# EAGLE design JKW (EAGLE 5.10)
01: air_temp; 02: fuse_check; 03: dz_sig; 04: dcf77_sig; 05: i2c_scl; 06: disp_backlight; 07: up; 08: right; 09: left; 10: down; 2: sdl; 3: 3.3V; 4: gnd; 5: 5V; WAY2: GND; WAY3: Sig
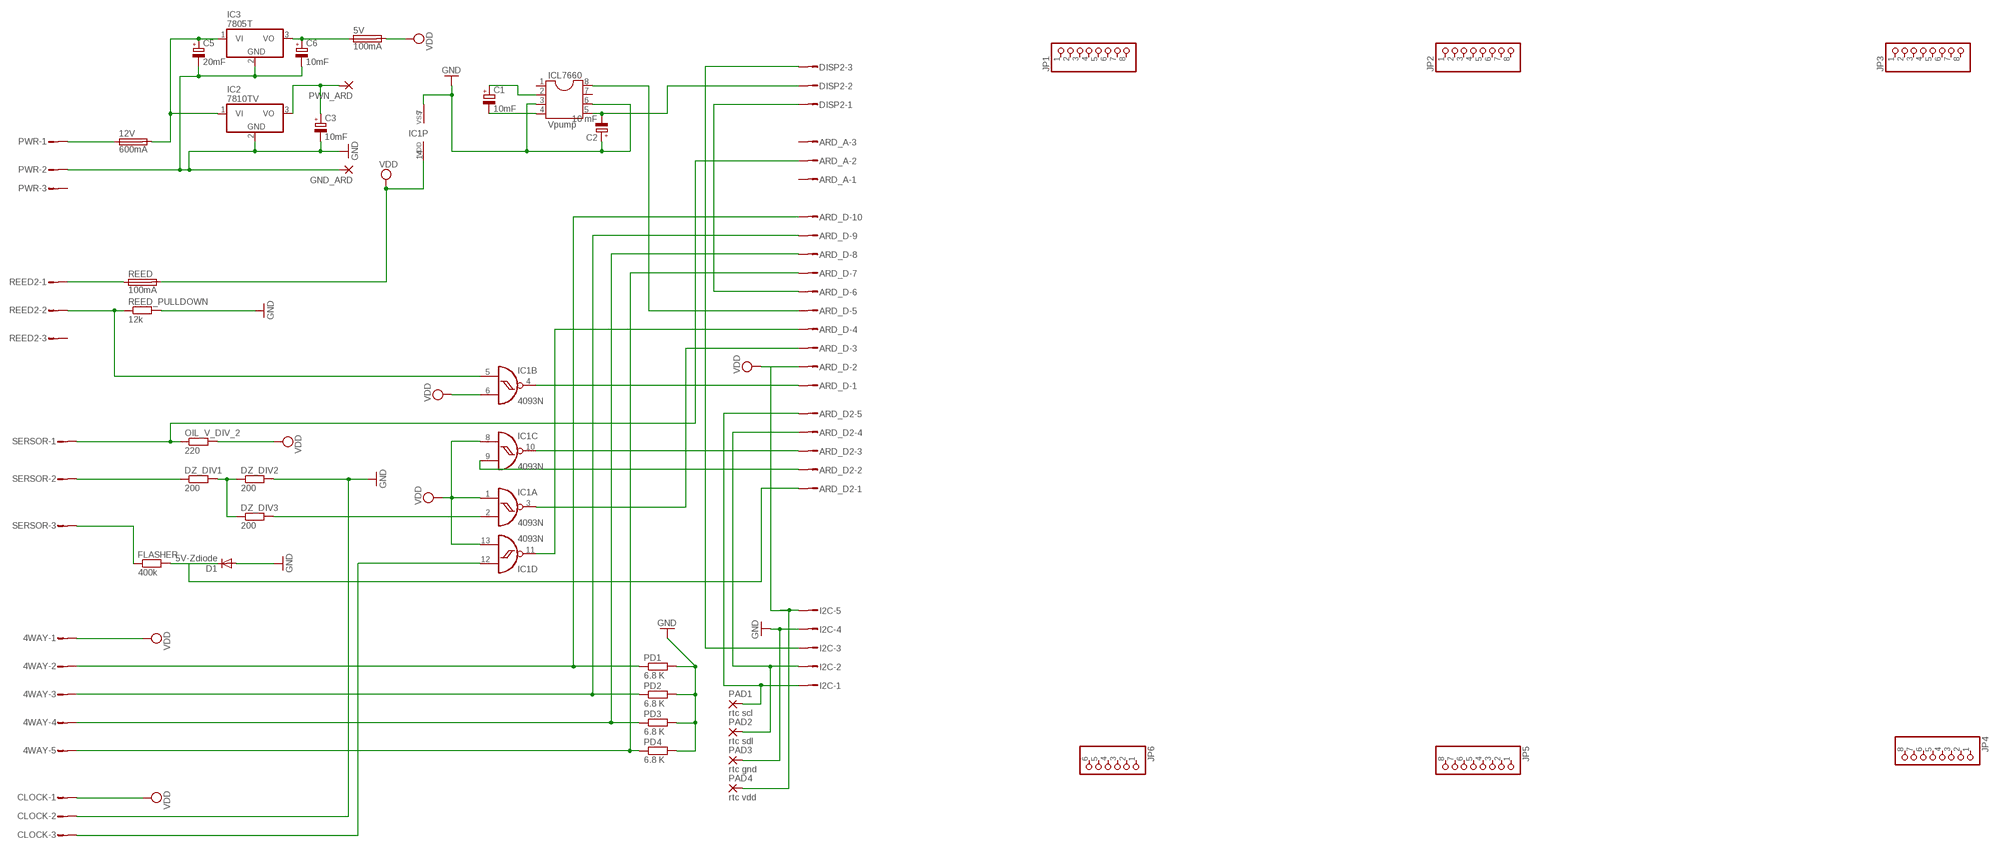
[diagram p0: schematic, sheet 1]

## Parts
4WAY  L05P  [L05P]
5V  100mA  SH22,5  [SH22,5]
12V  600mA  SH22,5  [SH22,5]
ARD_A  L03P  [L03P]
ARD_D  L10P  [L10P]
ARD_D2  L05P  [L05P]
C1  10mF  CPOL-EUE2-5  [E2-5]
C2  10 mF  CPOL-EUE2-5  [E2-5]
C3  10mF  CPOL-EUE2-5  [E2-5]
C5  20mF  CPOL-EUE2-5  [E2-5]
C6  10mF  CPOL-EUE2-5  [E2-5]
CLOCK  L03P  [L03P]
D1  5V-Zdiode  1N4004  [DO41-10]
DISP2  L03P  [L03P]
DZ_DIV1  200  R-EU_0309/12  [0309/12]
DZ_DIV2  200  R-EU_0309/12  [0309/12]
DZ_DIV3  200  R-EU_0309/12  [0309/12]
FLASHER  400k  R-EU_0309/12  [0309/12]
GND_ARD  3,81/1,1  [3,81/1,1]
I2C  L05P  [L05P]
IC1  4093N  [DIL14]
IC2  7810TV  7805T  [TO220H]
IC3  7805T  [TO220H]
ICL7660  Vpump  DIL8  [DIL08]
JP1  PINHD-1X8  [1X08]
JP2  PINHD-1X8  [1X08]
JP3  PINHD-1X8  [1X08]
JP4  PINHD-1X8  [1X08]
JP5  PINHD-1X8  [1X08]
JP6  PINHD-1X6  [1X06]
OIL_V_DIV_2  220  R-EU_0309/12  [0309/12]
PAD1  rtc scl  WIREPAD2,54/0,8  [2,54/0,8]
PAD2  rtc sdl  WIREPAD2,54/0,8  [2,54/0,8]
PAD3  rtc gnd  WIREPAD2,54/0,8  [2,54/0,8]
PAD4  rtc vdd  WIREPAD2,54/0,8  [2,54/0,8]
PD1  6.8 K  R-EU_0309/12  [0309/12]
PD2  6.8 K  R-EU_0309/12  [0309/12]
PD3  6.8 K  R-EU_0309/12  [0309/12]
PD4  6.8 K  R-EU_0309/12  [0309/12]
PWN_ARD  3,81/1,1  [3,81/1,1]
PWR  L03P  [L03P]
REED  100mA  SH22,5  [SH22,5]
REED2  L03P  [L03P]
REED_PULLDOWN  12k  R-EU_0309/12  [0309/12]
SERSOR  L03P  [L03P]

## Nets
GND: C2.+ C3.- C5.- C6.- CLOCK.2 D1.A DZ_DIV2.2 GND_ARD.1(P) I2C.4 IC1.7(P:VSS) IC2.2(GND) IC3.2(GND) ICL7660.3 ICL7660.6 PAD3.1(P) PD1.2 PD2.2 PD3.2 PD4.2 PWR.2 REED_PULLDOWN.2
N$1: 12V.1 PWR.1
N$3: REED2.1 REED.1
N$4: IC1.5(B:I0) REED2.2 REED_PULLDOWN.1
N$5: 4WAY.5 ARD_D.7 PD4.1
N$6: DISP2.3 I2C.3
N$7: ARD_D.1 IC1.4(B:O)
N$8: DZ_DIV1.1 SERSOR.2
N$9: ARD_D2.4 I2C.2 PAD2.1(P)
N$10: DZ_DIV3.2 IC1.2(A:I1)
N$11: ARD_A.2 OIL_V_DIV_2.1 SERSOR.1
N$12: ARD_D.3 IC1.3(A:O)
N$13: 4WAY.4 ARD_D.8 PD3.1
N$14: 4WAY.3 ARD_D.9 PD2.1
N$15: 4WAY.2 ARD_D.10 PD1.1
N$16: ARD_D2.5 I2C.1 PAD1.1(P)
N$18: ARD_D.4 IC1.11(D:O)
N$19: 5V.1 C6.+ IC3.3(VO)
N$20: ARD_D.6 DISP2.1
N$21: FLASHER.1 SERSOR.3
N$22: ARD_D.5 ICL7660.8
N$23: C1.- ICL7660.4
N$24: C2.- DISP2.2 ICL7660.5
N$25: C1.+ ICL7660.2
N$27: 4WAY.1 5V.2 ARD_D.2 CLOCK.1 I2C.5 IC1.1(A:I0) IC1.6(B:I1) IC1.8(C:I0) IC1.13(D:I1) IC1.14(P:VDD) OIL_V_DIV_2.2 PAD4.1(P) REED.2 ; supply symbol labelled VDD
N$28: ARD_D2.3 IC1.10(C:O)
N$29: DZ_DIV1.2 DZ_DIV2.1 DZ_DIV3.1
N$30: ARD_D2.1 D1.C FLASHER.2
N$32: C3.+ IC2.3(VO) PWN_ARD.1(P)
N$33: CLOCK.3 IC1.12(D:I0)
N$34: ARD_D2.2 IC1.9(C:I1)
N$40: 12V.2 C5.+ IC2.1(VI) IC3.1(VI)
Unconnected: ARD_A.1 ARD_A.3 ICL7660.1 ICL7660.7 JP1.1 JP1.2 JP1.3 JP1.4 JP1.5 JP1.6 JP1.7 JP1.8 JP2.1 JP2.2 JP2.3 JP2.4 JP2.5 JP2.6 JP2.7 JP2.8 JP3.1 JP3.2 JP3.3 JP3.4 JP3.5 JP3.6 JP3.7 JP3.8 JP4.1 JP4.2 JP4.3 JP4.4 JP4.5 JP4.6 JP4.7 JP4.8 JP5.1 JP5.2 JP5.3 JP5.4 JP5.5 JP5.6 JP5.7 JP5.8 JP6.1 JP6.2 JP6.3 JP6.4 JP6.5 JP6.6 PWR.3 REED2.3

## Library data of the parts
4WAY ARD_D2 I2C = con-amp-mt:L05P: AMP MT CONNECTOR
5V 12V REED = fuse:SH22,5: FUSE HOLDER grid 22,5 mm, OGN0031 8201, Schurter (Buerklin)
ARD_A CLOCK DISP2 PWR REED2 SERSOR = con-amp-mt:L03P: AMP MT CONNECTOR
ARD_D = con-amp-mt:L10P: AMP MT CONNECTOR
C1-C3 C5 C6 = resistor:CPOL-EU: POLARIZED CAPACITOR, European symbol
D1 = diode:1N4004: DIODE general purpose rectifier, 1 A
DZ_DIV1-DZ_DIV3 FLASHER OIL_V_DIV_2 PD1-PD4 REED_PULLDOWN = resistor:R-EU_: RESISTOR, European symbol
GND_ARD PWN_ARD = wirepad:3,81/1,1: THROUGH-HOLE PAD
IC1 = 40xx:4093: Quad 2-input NAND schmitt trigger
IC2 IC3 = linear:78*: Positive VOLTAGE REGULATOR Source: http://cache.national.com/ds/LM/LM78L05.pdf http://www.fairchildsemi.com/ds/LM/LM7805.pdf
ICL7660 = ic-package:DIL8: Dual In Line / Socket
JP1-JP5 = pinhead:PINHD-1X8: PIN HEADER
JP6 = pinhead:PINHD-1X6: PIN HEADER
PAD1-PAD4 = wirepad:WIREPAD: Wire PAD connect wire on PCB

## Board
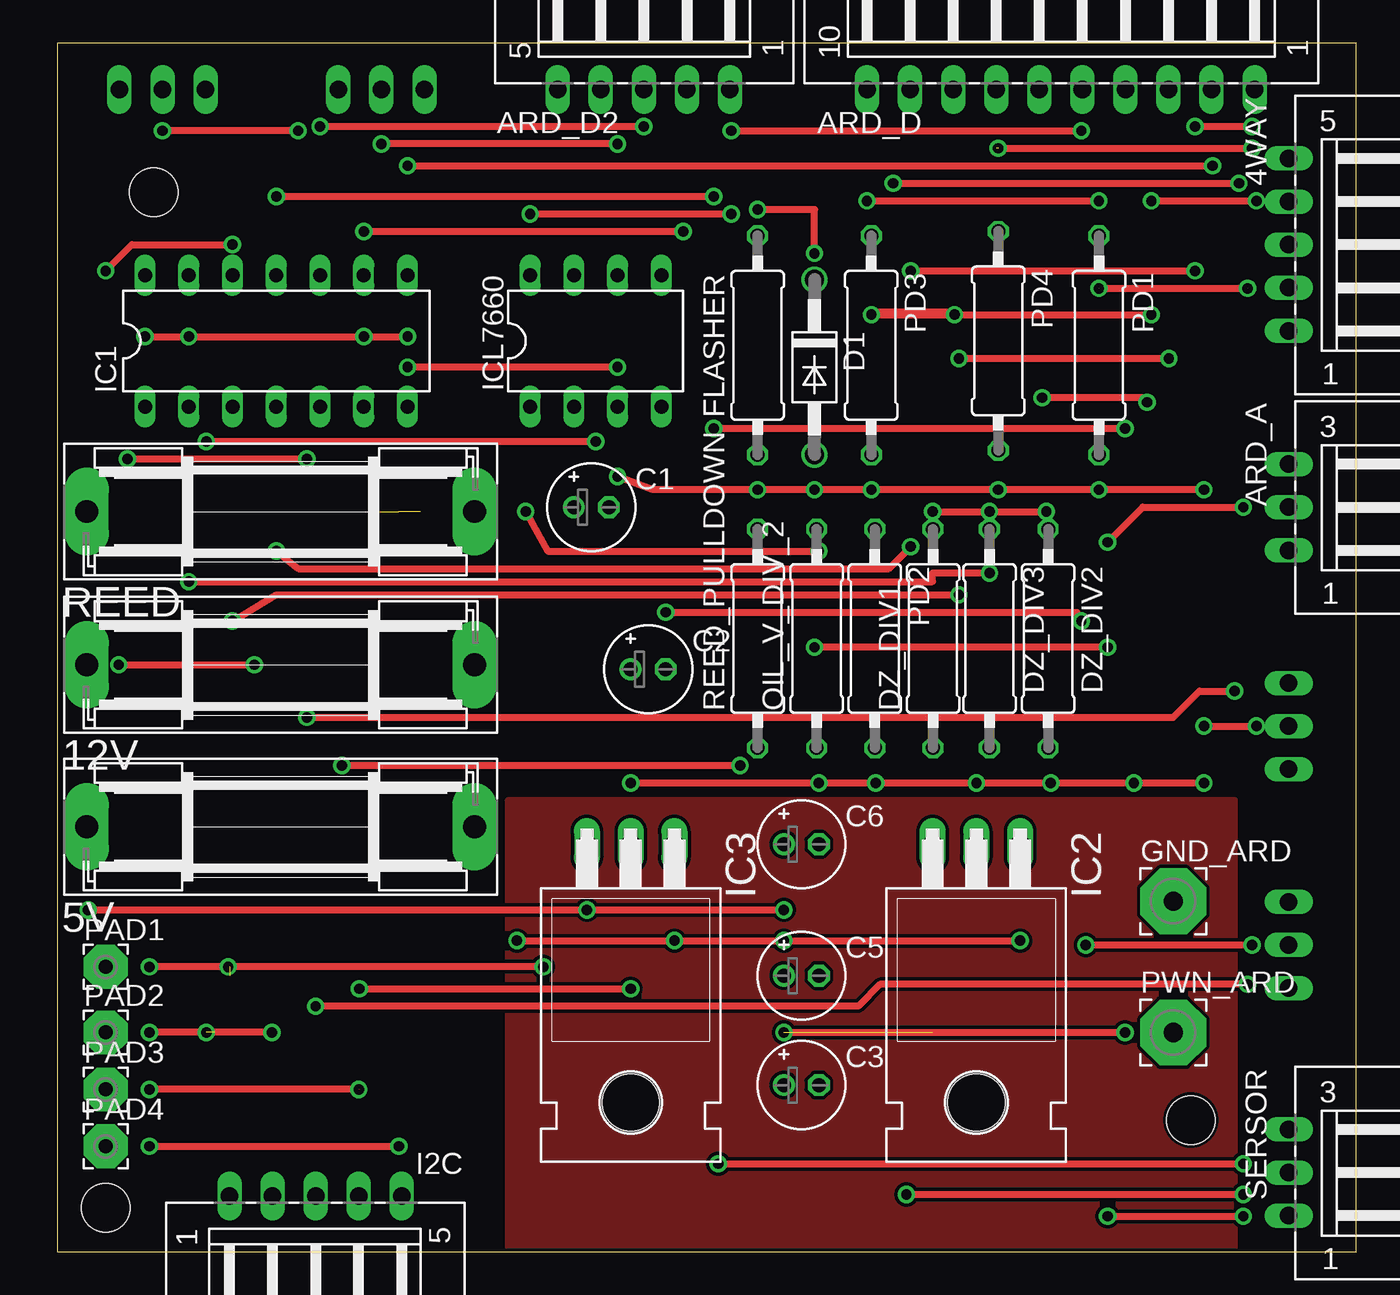
[diagram p1: board, top side]
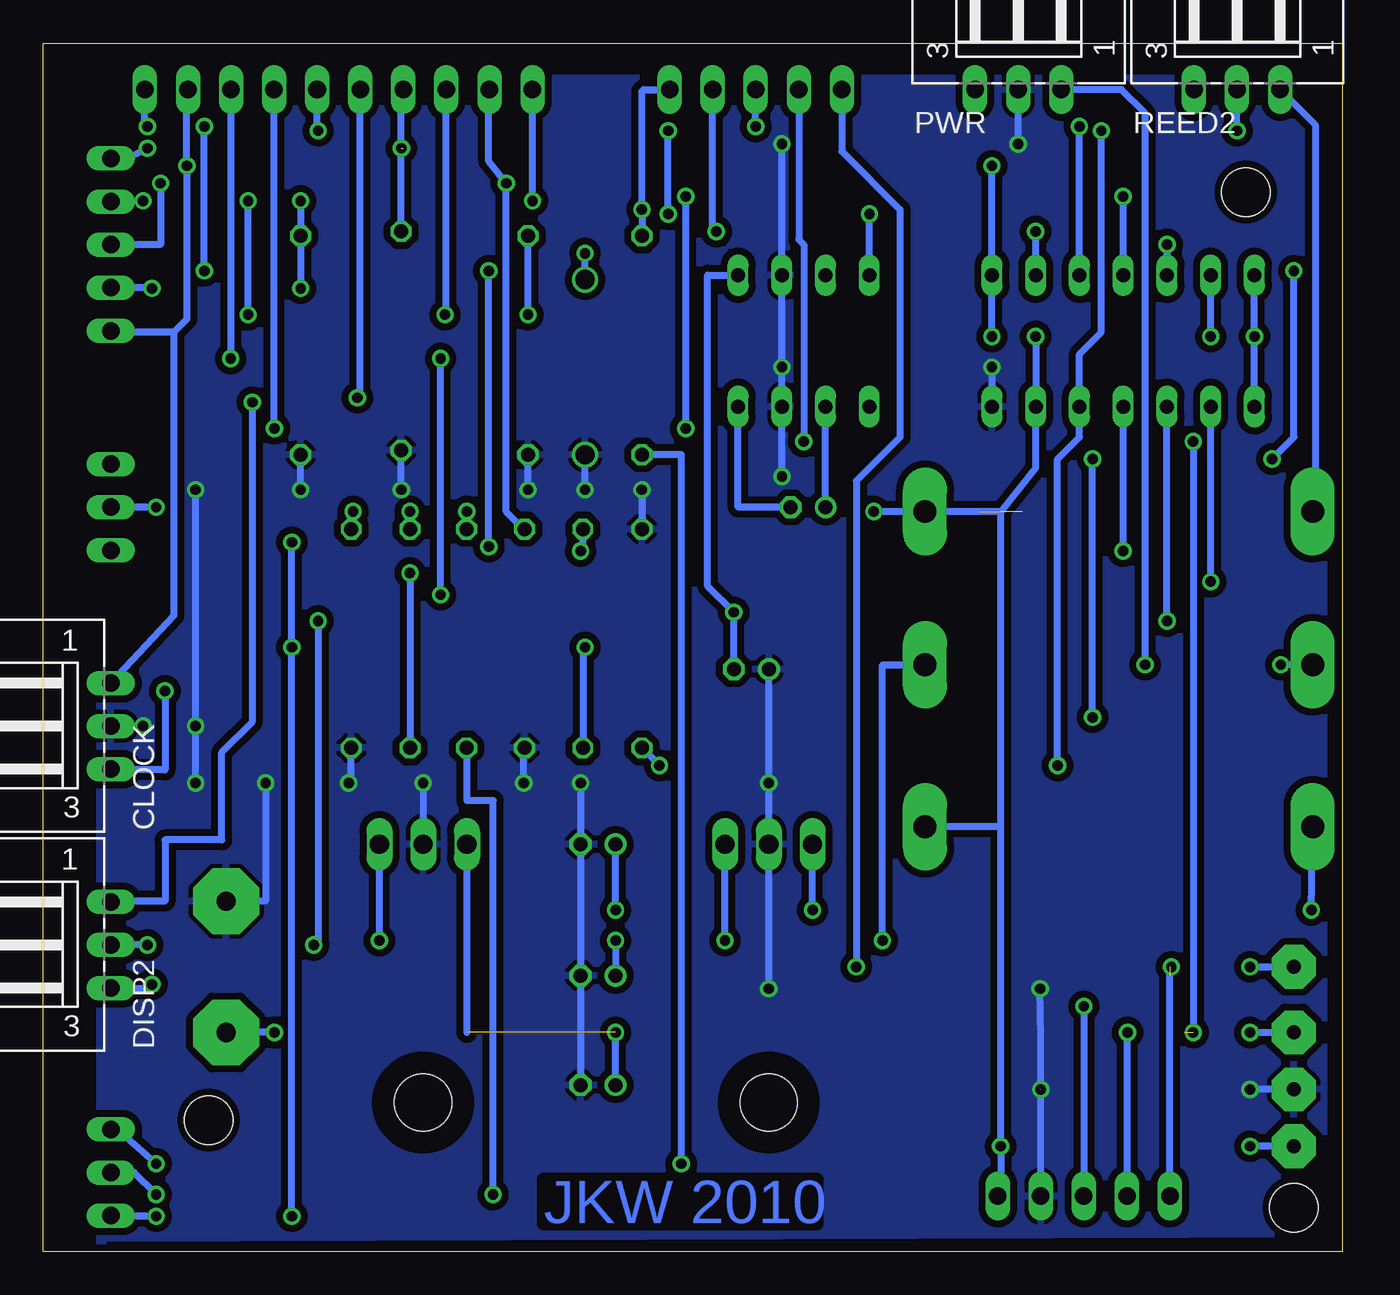
[diagram p2: board, bottom side, seen from below]

Size 75.42 x 70.13 mm. Coordinates in mm from the lower left corner, seen from the top.
Outline: 0,0 75.42,0 75.42,70.13 0,70.13 0,0
Copper layers (1*16): Top 0.035mm / dielectric 1.5mm / Bottom 0.035mm
Design rules "ZWILLING": minimum track width 0.2mm, minimum drill 0.5mm, track to track 0.2mm, track to pad 0.2mm, pad to pad 0.15mm, via to via 0.2mm, smd to smd 0mil, copper to edge 0.2mm, drill to drill 0.2mm, minimum pad ring 0.2mm, minimum via ring 0.2mm, stop-mask expansion 0.1mm, vias tented up to drill 0mil, thermal gap 10mil
Holes 2.8 mm at 65.81,7.64 5.61,61.49 2.81,2.56

### Footprints (pad centres in the part's own frame; a part is rotated, then mirrored left to right if it is on the bottom)
L05P = drill 1.016 long: 1 5,-6.25; 2 2.5,-6.25; 3 0,-6.25; 4 -2.5,-6.25; 5 -5,-6.25
SH22,5 = drill 1.321 pad 2.54 long: 1 -11.252,0; 2 11.252,0
L03P = drill 1.016 long: 1 2.5,-6.25; 2 0,-6.25; 3 -2.5,-6.25
L10P = drill 1.016 long: 1 11.25,-6.25; 2 8.75,-6.25; 3 6.25,-6.25; 4 3.75,-6.25; 5 1.25,-6.25; 6 -1.25,-6.25; 7 -3.75,-6.25; 8 -6.25,-6.25; 9 -8.75,-6.25; 10 -11.25,-6.25
E2-5 = drill 0.813 pad 1.27 round: + -1.016,0 | drill 0.813 pad 1.27 octagon: - 1.016,0
DO41-10 = drill 1.118 round: A 5.08,0; C -5.08,0
0309/12 = drill 0.813 octagon: 1 -6.35,0; 2 6.35,0
3,81/1,1 = drill 1.118 pad 3.81 octagon: 1 0,0
DIL14 = drill 0.813 long: 1 -7.62,-3.81; 2 -5.08,-3.81; 3 -2.54,-3.81; 4 0,-3.81; 5 2.54,-3.81; 6 5.08,-3.81; 7 7.62,-3.81; 8 7.62,3.81; 9 5.08,3.81; 10 2.54,3.81; 11 0,3.81; 12 -2.54,3.81; 13 -5.08,3.81; 14 -7.62,3.81
TO220H = drill 1.118 long: 1 -2.54,-10.16; 2 0,-10.16; 3 2.54,-10.16 | hole 3.302: 0,4.826
DIL08 = drill 0.813 long: 1 -3.81,-3.81; 2 -1.27,-3.81; 3 1.27,-3.81; 4 3.81,-3.81; 5 3.81,3.81; 6 1.27,3.81; 7 -1.27,3.81; 8 -3.81,3.81
1X08 = drill 1.016 long: 1 -8.89,0; 2 -6.35,0; 3 -3.81,0; 4 -1.27,0; 5 1.27,0; 6 3.81,0; 7 6.35,0; 8 8.89,0
1X06 = drill 1.016 long: 1 -6.35,0; 2 -3.81,0; 3 -1.27,0; 4 1.27,0; 5 3.81,0; 6 6.35,0
2,54/0,8 = drill 0.813 pad 2.54 octagon: 1 0,0

### Placement (x,y rotation side)
4WAY  77.74,58.44 270 top
5V  12.97,24.66 0 top
12V  12.97,34.06 0 top
ARD_A  77.74,43.2 270 top
ARD_D  58.26,73.68 0 top
ARD_D2  34.06,73.68 0 top
C1  31.01,43.2 0 top
C2  34.31,33.8 0 top
C3  43.2,9.67 0 top
C5  43.2,16.02 0 top
C6  43.2,23.64 0 top
CLOCK  77.74,30.5 90 bottom
D1  43.96,51.33 270 top
DISP2  77.74,17.8 90 bottom
DZ_DIV1  50.85,35.58 90 top
DZ_DIV2  57.53,35.58 270 top
DZ_DIV3  54.12,35.58 270 top
FLASHER  40.66,52.6 90 top
GND_ARD  64.79,20.34 0 top
I2C  15.01,-3.03 180 top
IC1  12.72,52.85 0 top
IC2  53.36,13.48 180 top
IC3  33.29,13.48 180 top
ICL7660  31.26,52.85 0 top
JP1  9.93,-14.97 0 top  (outside the outline)
JP2  9.42,-21.06 0 top  (outside the outline)
JP3  8.91,-27.16 0 top  (outside the outline)
JP4  8.4,-33.25 0 top  (outside the outline)
JP5  7.89,-39.35 0 top  (outside the outline)
JP6  4.85,-45.45 0 top  (outside the outline)
OIL_V_DIV_2  44.09,35.58 90 top
PAD1  2.81,16.53 0 top
PAD2  2.81,12.72 0 top
PAD3  2.81,9.42 0 top
PAD4  2.81,6.12 0 top
PD1  60.47,52.6 270 top
PD2  47.47,35.58 270 top
PD3  47.26,52.6 270 top
PD4  54.63,52.85 270 top
PWN_ARD  64.79,12.72 0 top
PWR  18.82,73.68 0 bottom
REED  12.97,42.95 0 top
REED2  6.12,73.68 0 bottom
REED_PULLDOWN  40.66,35.58 90 top
SERSOR  77.74,4.59 270 top

### Tracks (layer width: path | path; a pad name or v marks a point on that pad's centre or on a via)
GND  (via drill 0.6)  (1 unrouted)
  Top 0.406: v33.29,27.2 v44.22,27.2 v47.52,27.2 v53.36,27.2 v57.68,27.2 v62.5,27.2 v66.57,27.2 | v66.57,44.22 v60.47,44.22 v54.63,44.22 v47.26,44.22 v43.96,44.22 v40.66,44.22 34.56,44.22 v32.53,44.98 | v32.53,51.33 v20.34,51.33 | v32.53,64.28 v18.82,64.28 | v66.57,30.5 v69.62,30.5 | v17.55,15.26 v33.29,15.26 | v17.51,9.42 v5.35,9.42
  Bottom 0.2: PWR.2 18.77,67.52 18.82,67.33 | PD2.2 47.52,28.77
  Bottom 0.406: v53.36,27.2 IC2.2 | C2.+ v33.29,27.2 IC3.2 v33.29,15.26 | 71.63,30.5 CLOCK.2 v69.62,30.5 | v62.5,27.2 62.5,20.34 GND_ARD.1 | PD2.2 47.52,29.23 v47.52,27.2 | v66.57,27.2 v66.57,30.5 v66.57,44.22 | v47.26,44.22 PD3.2 | v43.96,44.22 D1.A | v40.66,44.22 REED_PULLDOWN.2 | v60.47,44.22 PD1.2 | v20.34,51.33 IC1.7 | v32.53,44.98 ICL7660.3 v32.53,51.33 ICL7660.6 v32.53,64.28 | v18.82,64.28 18.82,67.33 | DZ_DIV2.2 57.53,27.35 v57.68,27.2 | v54.63,44.22 PD4.2 | C3.- C5.- C6.- v44.22,27.2 | I2C.4 v17.51,9.42 17.51,12.43 v17.55,15.26 | PAD3.1 v5.35,9.42
  pour Bottom (isolate 0.406): 1.04,1.04 1.04,68.09 72.16,68.09 72.16,0.53 71.9,0.53 71.9,0.78
N$1  (via drill 0.6)
  Top 0.406: v3.58,34.06 v11.45,34.06
  Bottom 0.406: PWR.1 12.82,67.43 11.45,66.06 v11.45,34.06 | 12V.1 v3.58,34.06
N$2
  pour Top: 26.18,26.18 26.18,0.27 68.35,0.27 68.35,26.18
N$3
  Bottom 0.406: REED.1 1.54,42.95 1.54,65.36 REED2.1
N$4  (via drill 0.6)
  Top 0.406: v13.99,65.04 v6.12,65.04 | v16.53,28.21 v39.64,28.21
  Bottom 0.406: v6.12,65.04 REED2.2 | v13.99,65.04 13.99,53.36 15.26,52.09 IC1.5 15.26,47.26 16.53,45.99 v16.53,28.21 | v39.64,28.21 REED_PULLDOWN.1
N$5  (via drill 0.6)  (1 unrouted)
  Top 0.406: 54.53,64.03 v69.36,64.03
  Bottom 0.406: PD4.1 v54.63,64.03 54.63,67.43 ARD_D.7 | 4WAY.5 70.46,63.44 v69.36,64.03
N$6  (via drill 0.6)
  Top 0.406: v69.11,15.51 47.77,15.51 46.5,14.24 v15.01,14.24
  Bottom 0.406: DISP2.3 69.11,15.3 v69.11,15.51 | v15.01,14.24 I2C.3
N$7  (via drill 0.6)
  Top 0.406: v66.06,65.3 v69.36,65.3 | v49.55,56.92 v66.06,56.92 | v49.55,40.91 48.28,39.64 13.99,39.64 v12.72,40.66
  Bottom 0.406: ARD_D.1 69.51,65.45 v69.36,65.3 | v66.06,56.92 v66.06,65.3 | v49.55,40.91 v49.55,56.92 | v12.72,40.66 IC1.4
N$8  (via drill 0.6)
  Top 0.406: v49.3,3.32 v68.85,3.32
  Bottom 0.406: SERSOR.2 70.12,4.59 v68.85,3.32 | v49.3,3.32 49.3,26.18 50.82,26.18 50.82,29.2 DZ_DIV1.1
N$9  (via drill 0.6)  (1 unrouted)
  Top 0.406: v12.47,12.72 v8.66,12.72 v5.35,12.72 | v31.26,47.01 v8.66,47.01
  Bottom 0.406: v5.35,12.72 PAD2.1 | v12.47,12.72 12.47,3.26 I2C.2 | ARD_D2.4 31.56,58.73 31.26,58.44 v31.26,47.01 | v8.66,47.01 v8.66,12.72
N$10  (via drill 0.6)
  Top 0.406: v7.64,38.88 50.82,38.88 50.82,39.39 v54.12,39.39
  Bottom 0.406: v7.64,38.88 IC1.2 | v54.12,39.39 DZ_DIV3.2
N$11  (via drill 0.6)
  Top 0.406: v60.98,41.17 63.01,43.2 v68.85,43.2 | v60.98,35.07 v43.96,35.07 | v60.98,2.05 v68.85,2.05
  Bottom 0.406: v68.85,43.2 ARD_A.2 | v60.98,41.17 v60.98,35.07 v60.98,2.05 | OIL_V_DIV_2.1 44.09,34.95 v43.96,35.07 | v68.85,2.05 71.49,2.05 SERSOR.1
N$12  (via drill 0.6)
  Top 0.406: v52.34,51.84 v64.54,51.84 | v52.34,38.12 12.72,38.12 v10.18,36.6
  Bottom 0.406: ARD_D.3 64.51,51.86 v64.54,51.84 | v52.34,38.12 v52.34,51.84 | v10.18,36.6 IC1.3
N$13  (via drill 0.6)
  Top 0.2: v47.26,54.38 47.01,54.63 52.09,54.63 v52.09,54.38
  Top 0.406: v47.26,54.38 51.84,54.38 | v63.52,60.98 v69.62,60.98 | v52.09,54.38 v63.52,54.38
  Bottom 0.406: v47.26,54.38 PD3.1 | 4WAY.4 71.1,60.94 v69.62,60.98 | v63.52,54.38 v63.52,60.98 | 51.84,54.38 v52.09,54.38 52.01,54.45 ARD_D.8
N$14  (via drill 0.6)
  Top 0.406: v48.53,62 v68.6,62
  Bottom 0.406: v68.6,62 68.6,58.44 4WAY.3 | PD2.1 47.52,41.93 48.53,42.95 v48.53,62 49.55,63.27 49.55,67.39 ARD_D.9
N$15  (via drill 0.6)  (2 unrouted)
  Top 0.406: v47.01,60.98 v60.47,60.98 | v60.47,55.9 v69.11,55.9
  Bottom 0.406: v60.47,60.98 PD1.1 v60.47,55.9 | v47.01,60.98 47.01,67.36 ARD_D.10 | 4WAY.2 69.15,55.94 v69.11,55.9
N$16  (via drill 0.6)  (1 unrouted)
  Top 0.406: v9.93,16.53 v5.35,16.53 | v28.21,16.53 10.01,16.53
  Bottom 0.406: I2C.1 10.01,16.45 v9.93,16.53 | v5.35,16.53 PAD1.1 | ARD_D2.5 29.06,63.85 25.67,60.47 25.67,47.26 28.21,44.72 v28.21,16.53
N$17  (1 unrouted)
N$18  (via drill 0.6)
  Top 0.406: v38.12,47.77 v62,47.77 | v12.72,61.23 v38.12,61.23
  Bottom 0.406: ARD_D.4 62.01,47.79 v62,47.77 | v38.12,61.23 v38.12,47.77 | IC1.11 v12.72,61.23
N$19  (via drill 0.6)
  Top 0.406: v1.8,19.83 v30.75,19.83 v42.18,19.83
  Bottom 0.406: 5V.1 1.72,24.84 v1.8,19.83 | v30.75,19.83 IC3.3 | v42.18,19.83 C6.+
N$20  (via drill 0.6)
  Top 0.406: v57.17,49.55 63.01,49.55 v63.27,49.3
  Bottom 0.406: ARD_D.6 57.01,49.71 v57.17,49.55 | v63.27,49.3 63.27,30.75 65.04,28.98 65.04,23.9 68.35,23.9 68.35,20.34 70.18,20.34 DISP2.1
N$21  (via drill 0.6)
  Top 0.406: v38.37,5.1 v68.85,5.1
  Bottom 0.406: v68.85,5.1 71.14,7.13 71.14,7.09 SERSOR.3 | v38.37,5.1 38.37,46.25 FLASHER.1
N$22  (via drill 0.6)
  Top 0.406: v39.14,65.04 v59.46,65.04 | v27.45,60.22 v39.14,60.22
  Bottom 0.406: ARD_D.5 59.51,65.1 v59.46,65.04 | v39.14,60.22 v39.14,65.04 | ICL7660.8 v27.45,60.22
N$23
  Bottom 0.406: C1.- 35.07,43.2 ICL7660.4
N$24  (via drill 0.6)
  Top 0.406: v35.33,37.1 59.2,37.1 v59.46,36.6 | v59.71,17.8 v69.36,17.8
  Bottom 0.406: C2.- v35.33,37.1 36.85,38.63 36.85,56.66 ICL7660.5 | v59.46,36.6 59.46,18.05 v59.71,17.8 | v69.36,17.8 DISP2.2
N$25
  Bottom 0.406: C1.+ ICL7660.2
N$27  (via drill 0.6)  (3 unrouted)
  Top 0.2: 27.45,42.48 27.52,42.52
  Top 0.406: v5.1,53.11 v7.64,53.11 v17.8,53.11 v20.34,53.11 | v20.34,63.01 v67.08,63.01 | v44.22,40.66 28.47,40.66 27.45,42.48 v27.2,42.95 | v5.35,6.12 v19.83,6.12
  Bottom 0.406: v7.64,53.11 IC1.13 | IC1.1 v5.1,53.11 IC1.14 | v17.8,53.11 IC1.6 17.8,45.49 19.83,42.95 | v20.34,53.11 IC1.8 v20.34,63.01 | ARD_D.2 67.08,67.43 v67.08,63.01 67.08,54.12 67.84,53.36 | 67.84,53.36 71.41,53.36 4WAY.1 | OIL_V_DIV_2.2 44.09,40.79 v44.22,40.66 | 19.83,24.66 5V.2 | 19.83,24.66 19.83,42.95 | 19.83,42.95 REED.2 v27.2,42.95 | CLOCK.1 67.84,36.91 67.84,53.36 | I2C.5 19.83,3.4 v19.83,6.12 19.83,24.66 | PAD4.1 v5.35,6.12
N$28  (via drill 0.6)
  Top 0.406: v15.26,65.3 v34.06,65.3
  Bottom 0.406: v34.06,65.3 ARD_D2.3 | IC1.10 v15.26,65.3
N$29  (via drill 0.6)
  Top 0.406: v50.82,42.95 v54.12,42.95 v57.42,42.95
  Bottom 0.406: DZ_DIV1.2 50.85,42.67 v50.82,42.95 | v54.12,42.95 DZ_DIV3.1 | DZ_DIV2.1 57.53,42.84 v57.42,42.95
N$30  (via drill 0.6)
  Top 0.406: v43.96,57.93 43.96,60.47 v40.66,60.47
  Bottom 0.406: ARD_D2.1 40.56,67.43 40.66,67.33 v40.66,60.47 FLASHER.2 | D1.C v43.96,57.93
N$32  (via drill 0.6)  (1 unrouted)
  Top 0.406: v42.18,12.72 v62,12.72
  Bottom 0.406: 50.82,12.72 IC2.3 | C3.+ v42.18,12.72 | v62,12.72 PWN_ARD.1
N$33  (via drill 0.6)
  Top 0.406: v10.18,58.44 4.34,58.44 v2.81,56.92 | v14.5,45.99 v4.08,45.99 | v14.5,31.01 64.28,31.01 64.79,31.01 66.31,32.53 v68.35,32.53
  Bottom 0.406: v10.18,58.44 IC1.12 | v2.81,56.92 2.81,47.26 v4.08,45.99 | v14.5,31.01 v14.5,45.99 | v68.35,32.53 68.35,27.96 71.45,27.96 CLOCK.3
N$34  (via drill 0.6)
  Top 0.406: v17.8,59.2 v36.34,59.2
  Bottom 0.406: ARD_D2.2 36.56,59.42 v36.34,59.2 | IC1.9 v17.8,59.2
N$40  (via drill 0.6)
  Top 0.406: v55.9,18.05 v42.18,18.05 v35.83,18.05 v26.69,18.05
  Bottom 0.406: v42.18,18.05 C5.+ | v55.9,18.05 IC2.1 | v35.83,18.05 IC3.1 | 12V.2 26.69,34.06 v26.69,18.05

### Text on the board
Bottom: JKW 2010